# EAGLE schematic half (EAGLE 8.2.2)
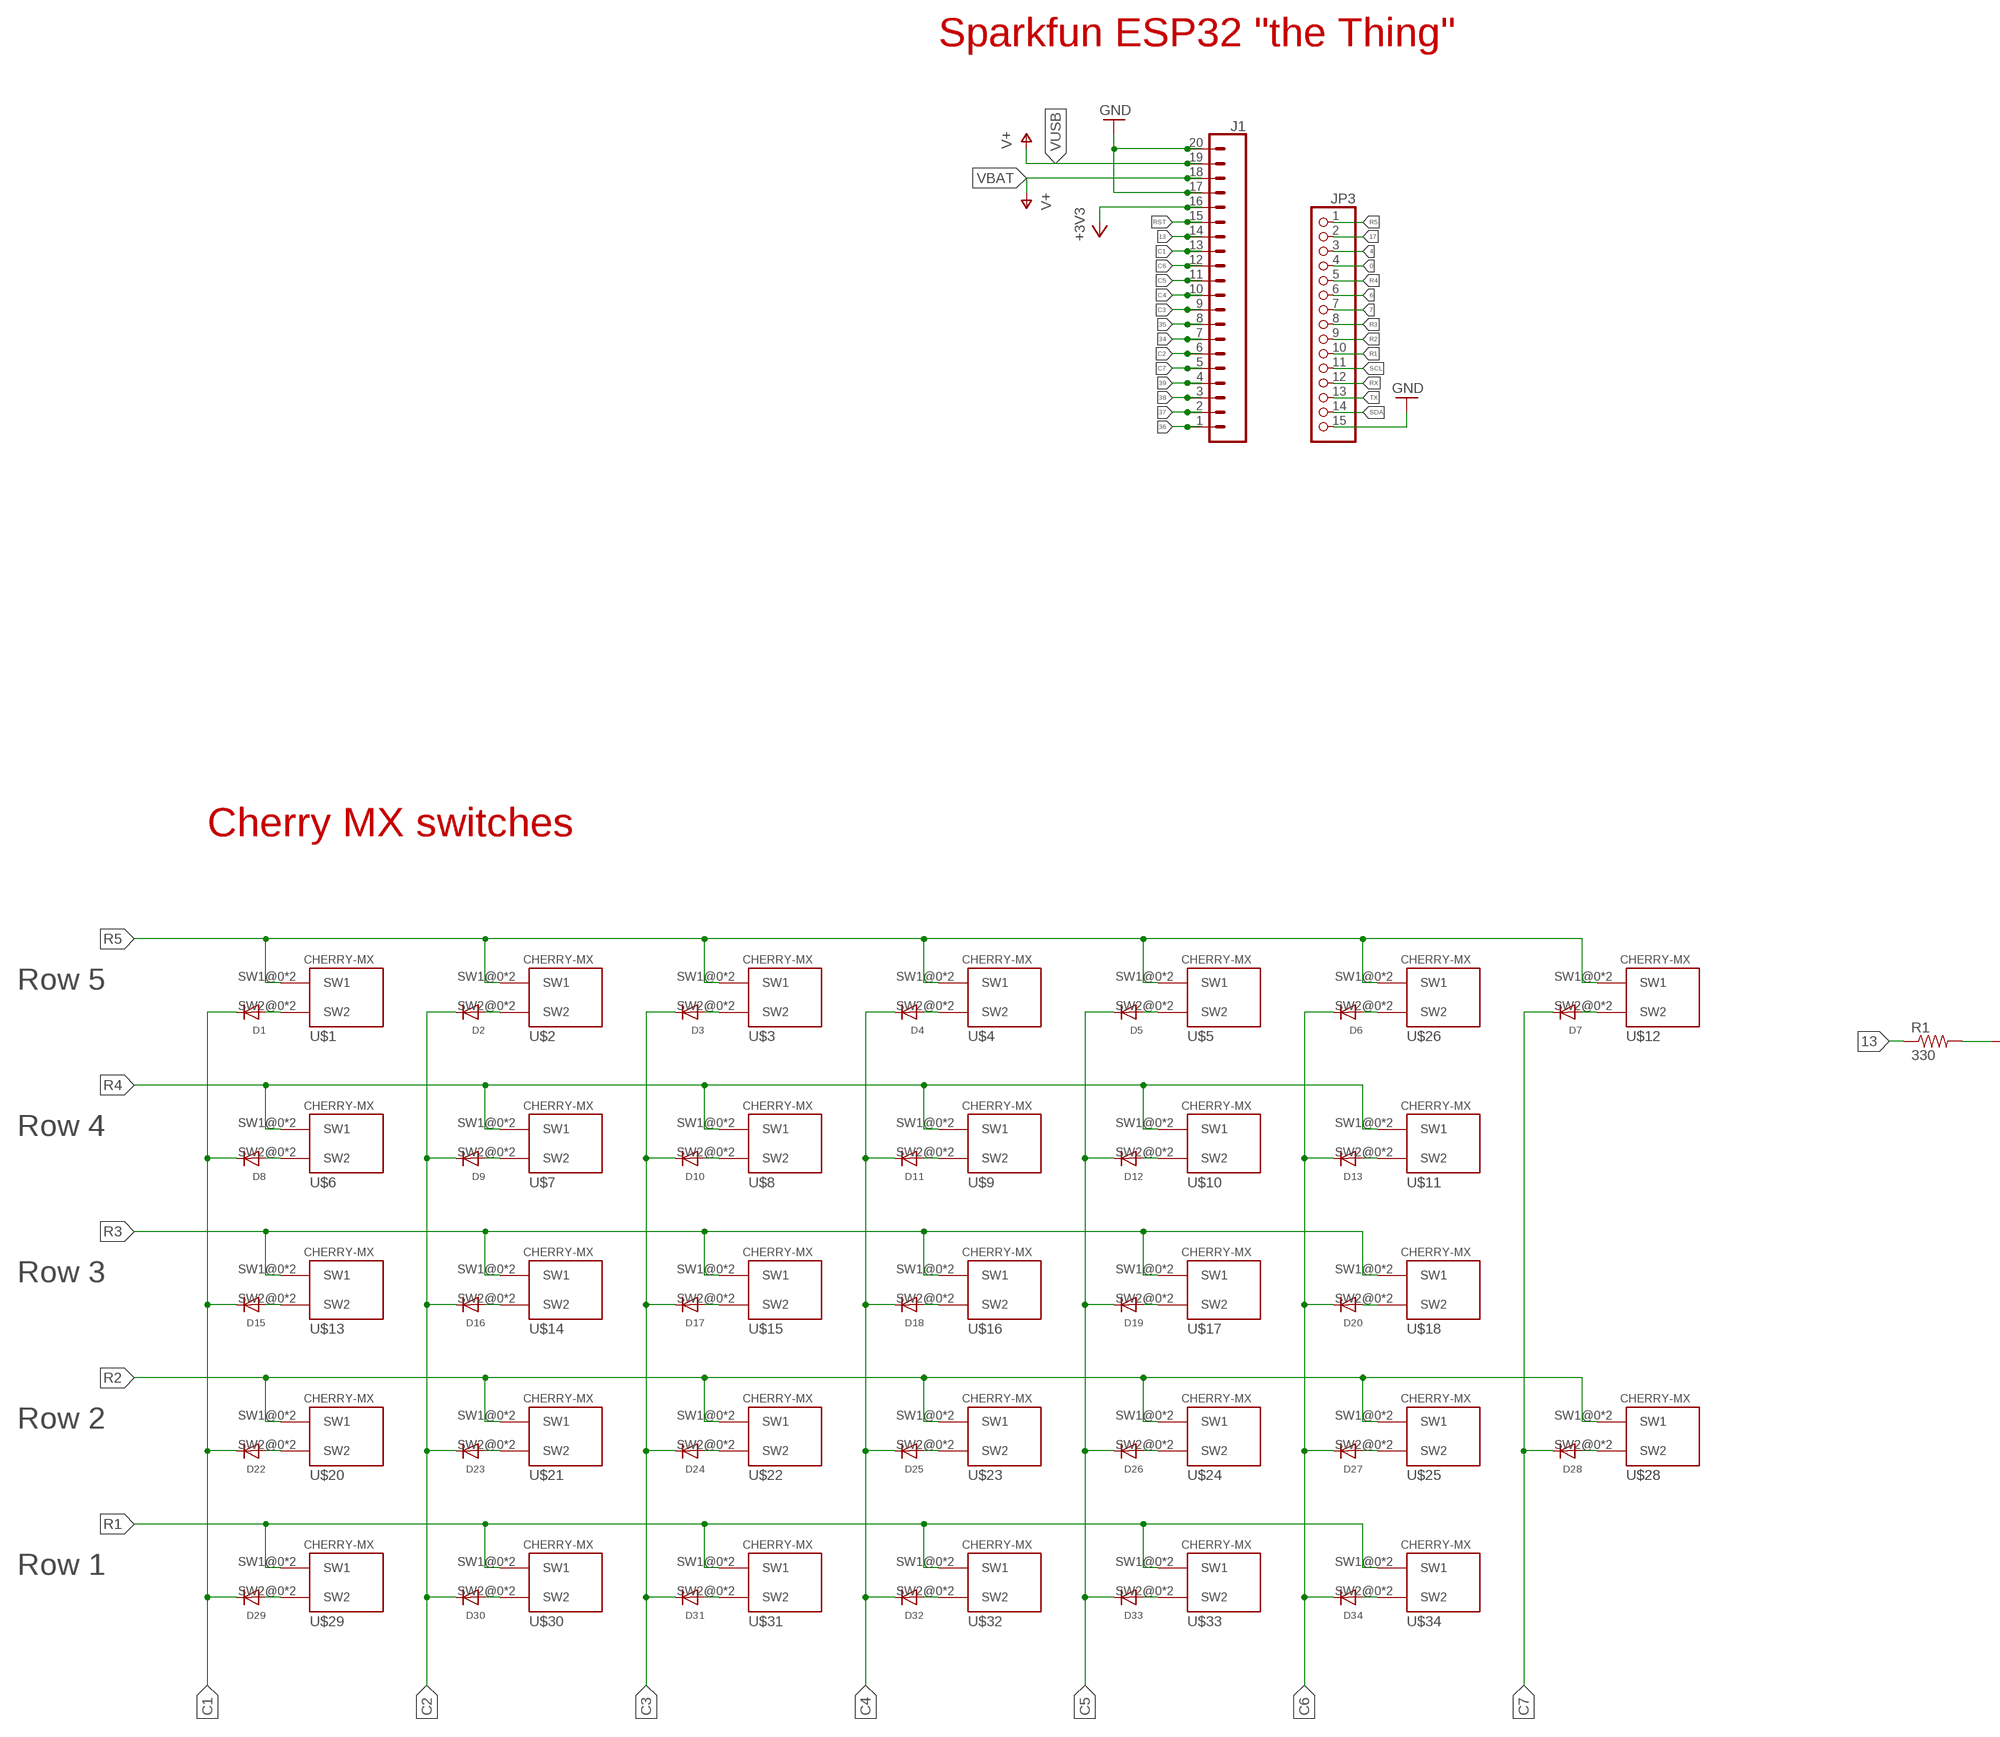
[diagram p0: schematic, sheet 1, part 1 of 3]
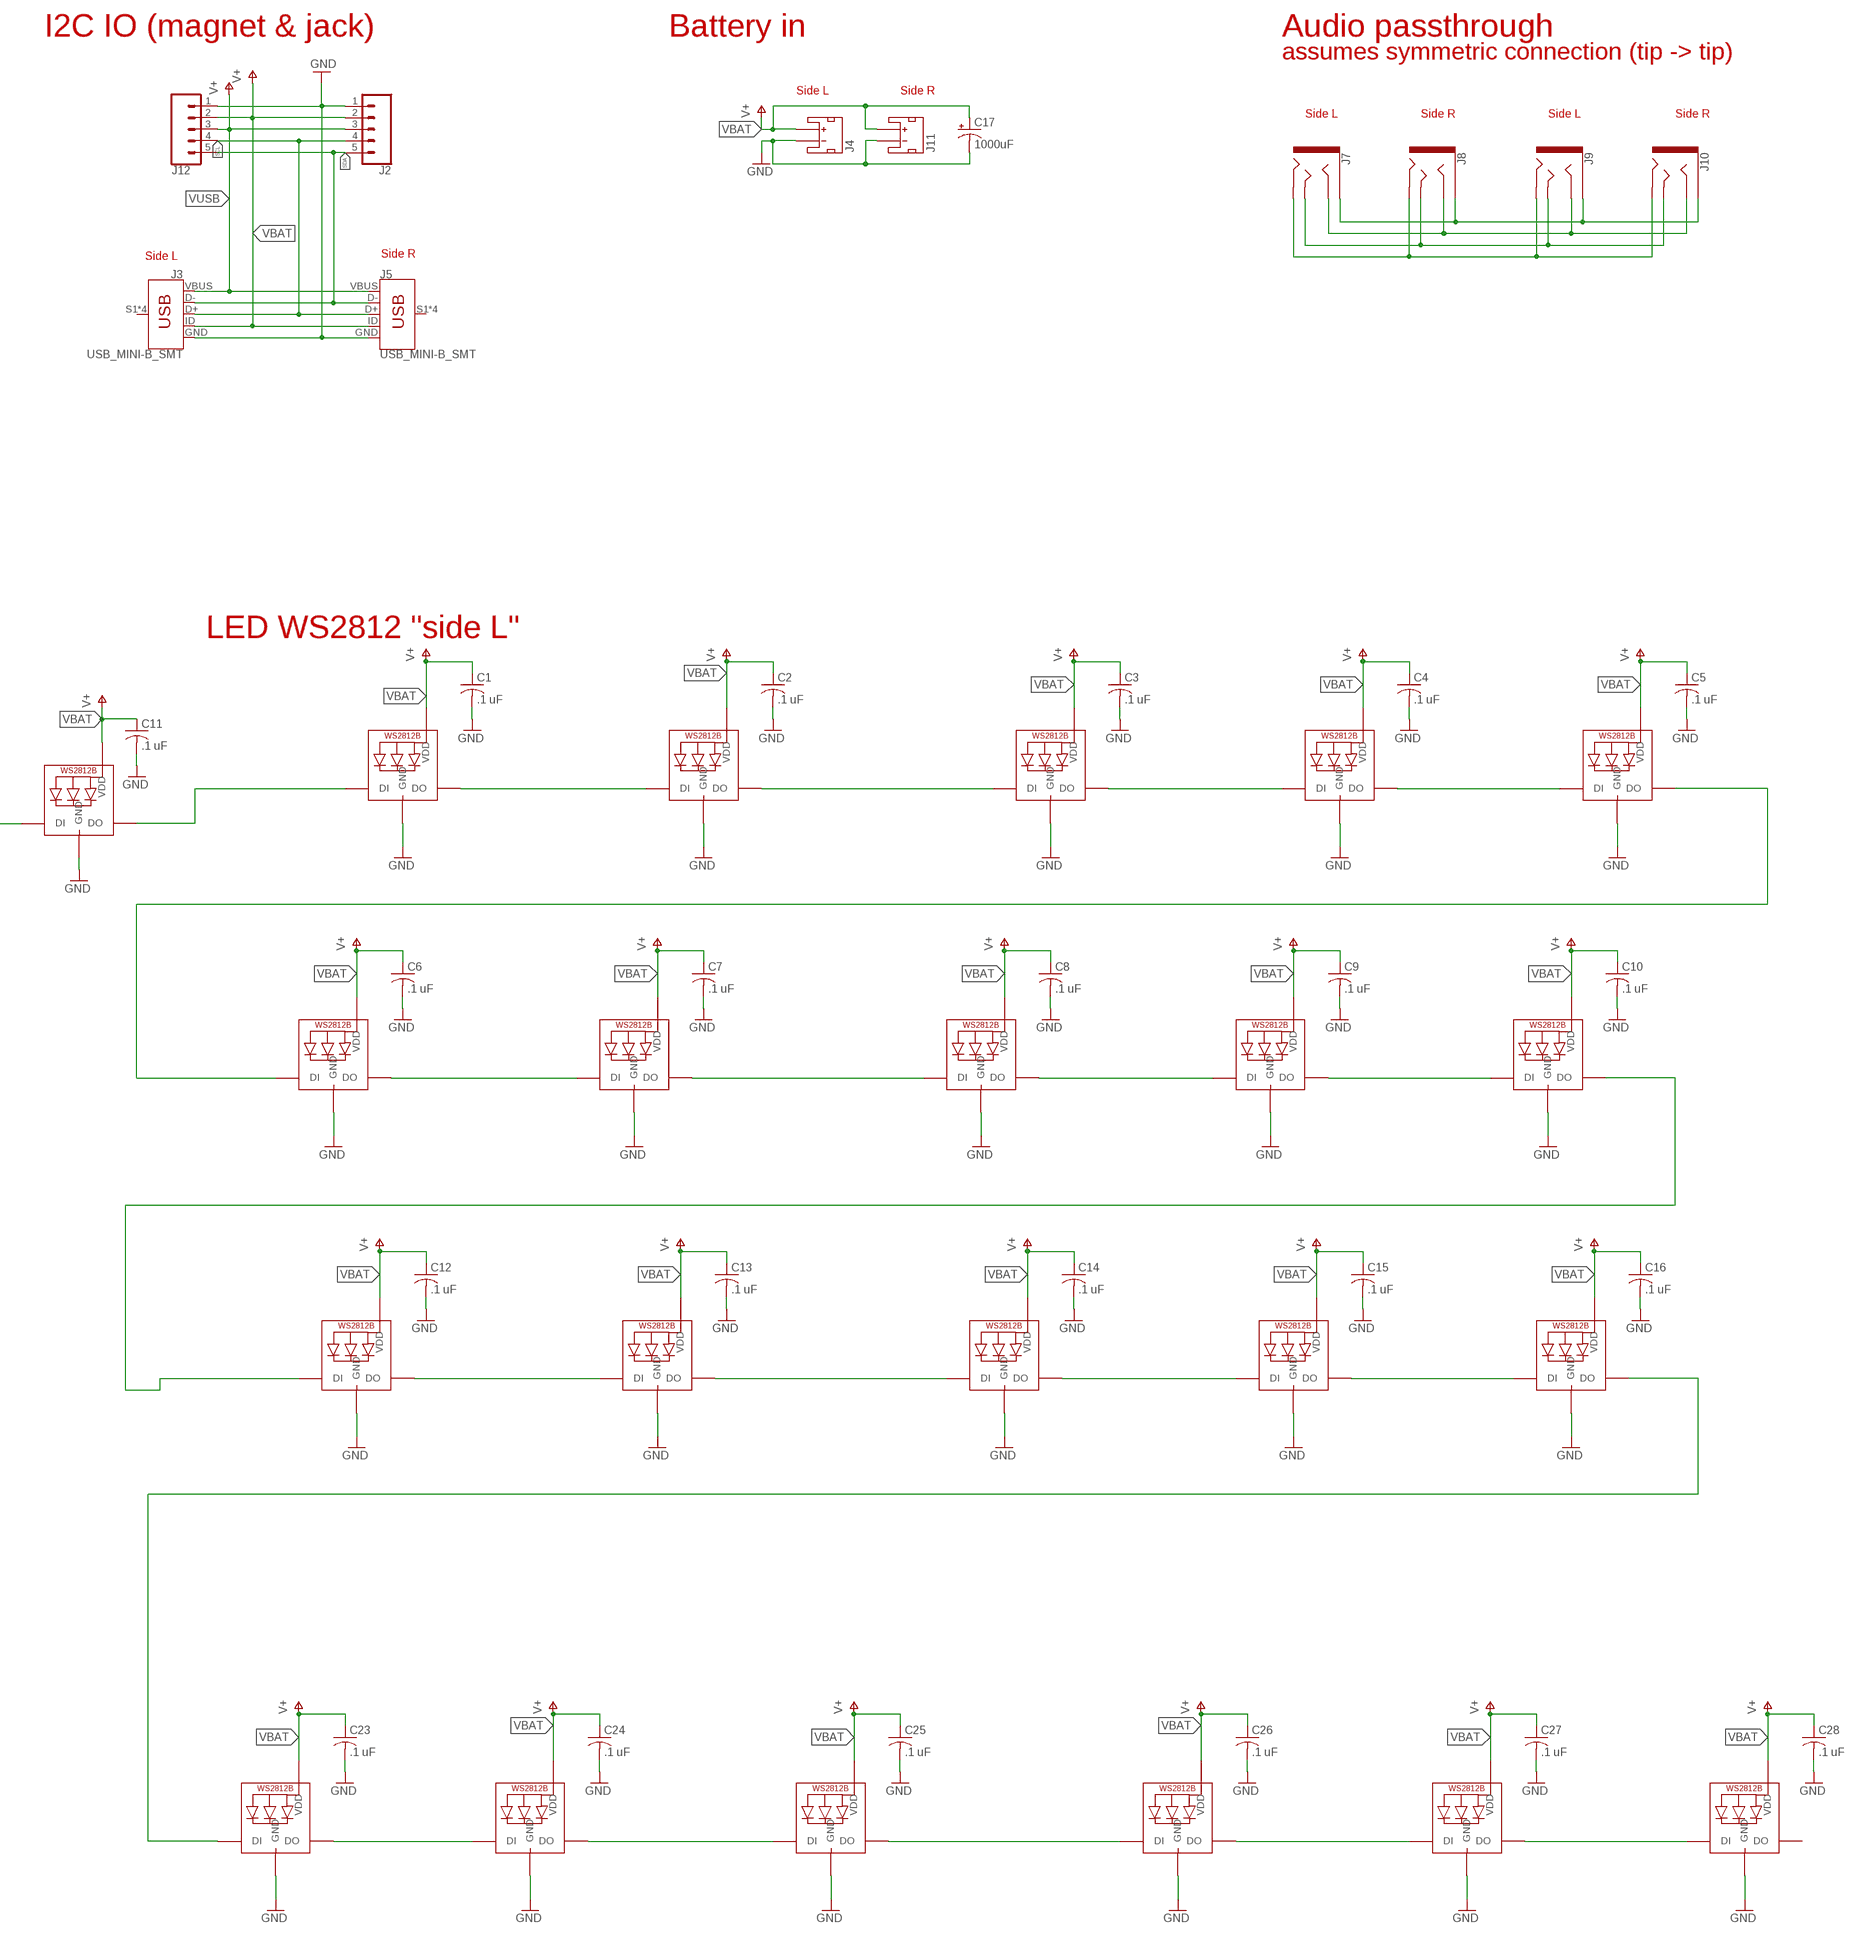
[diagram p1: schematic, sheet 1, part 2 of 3]
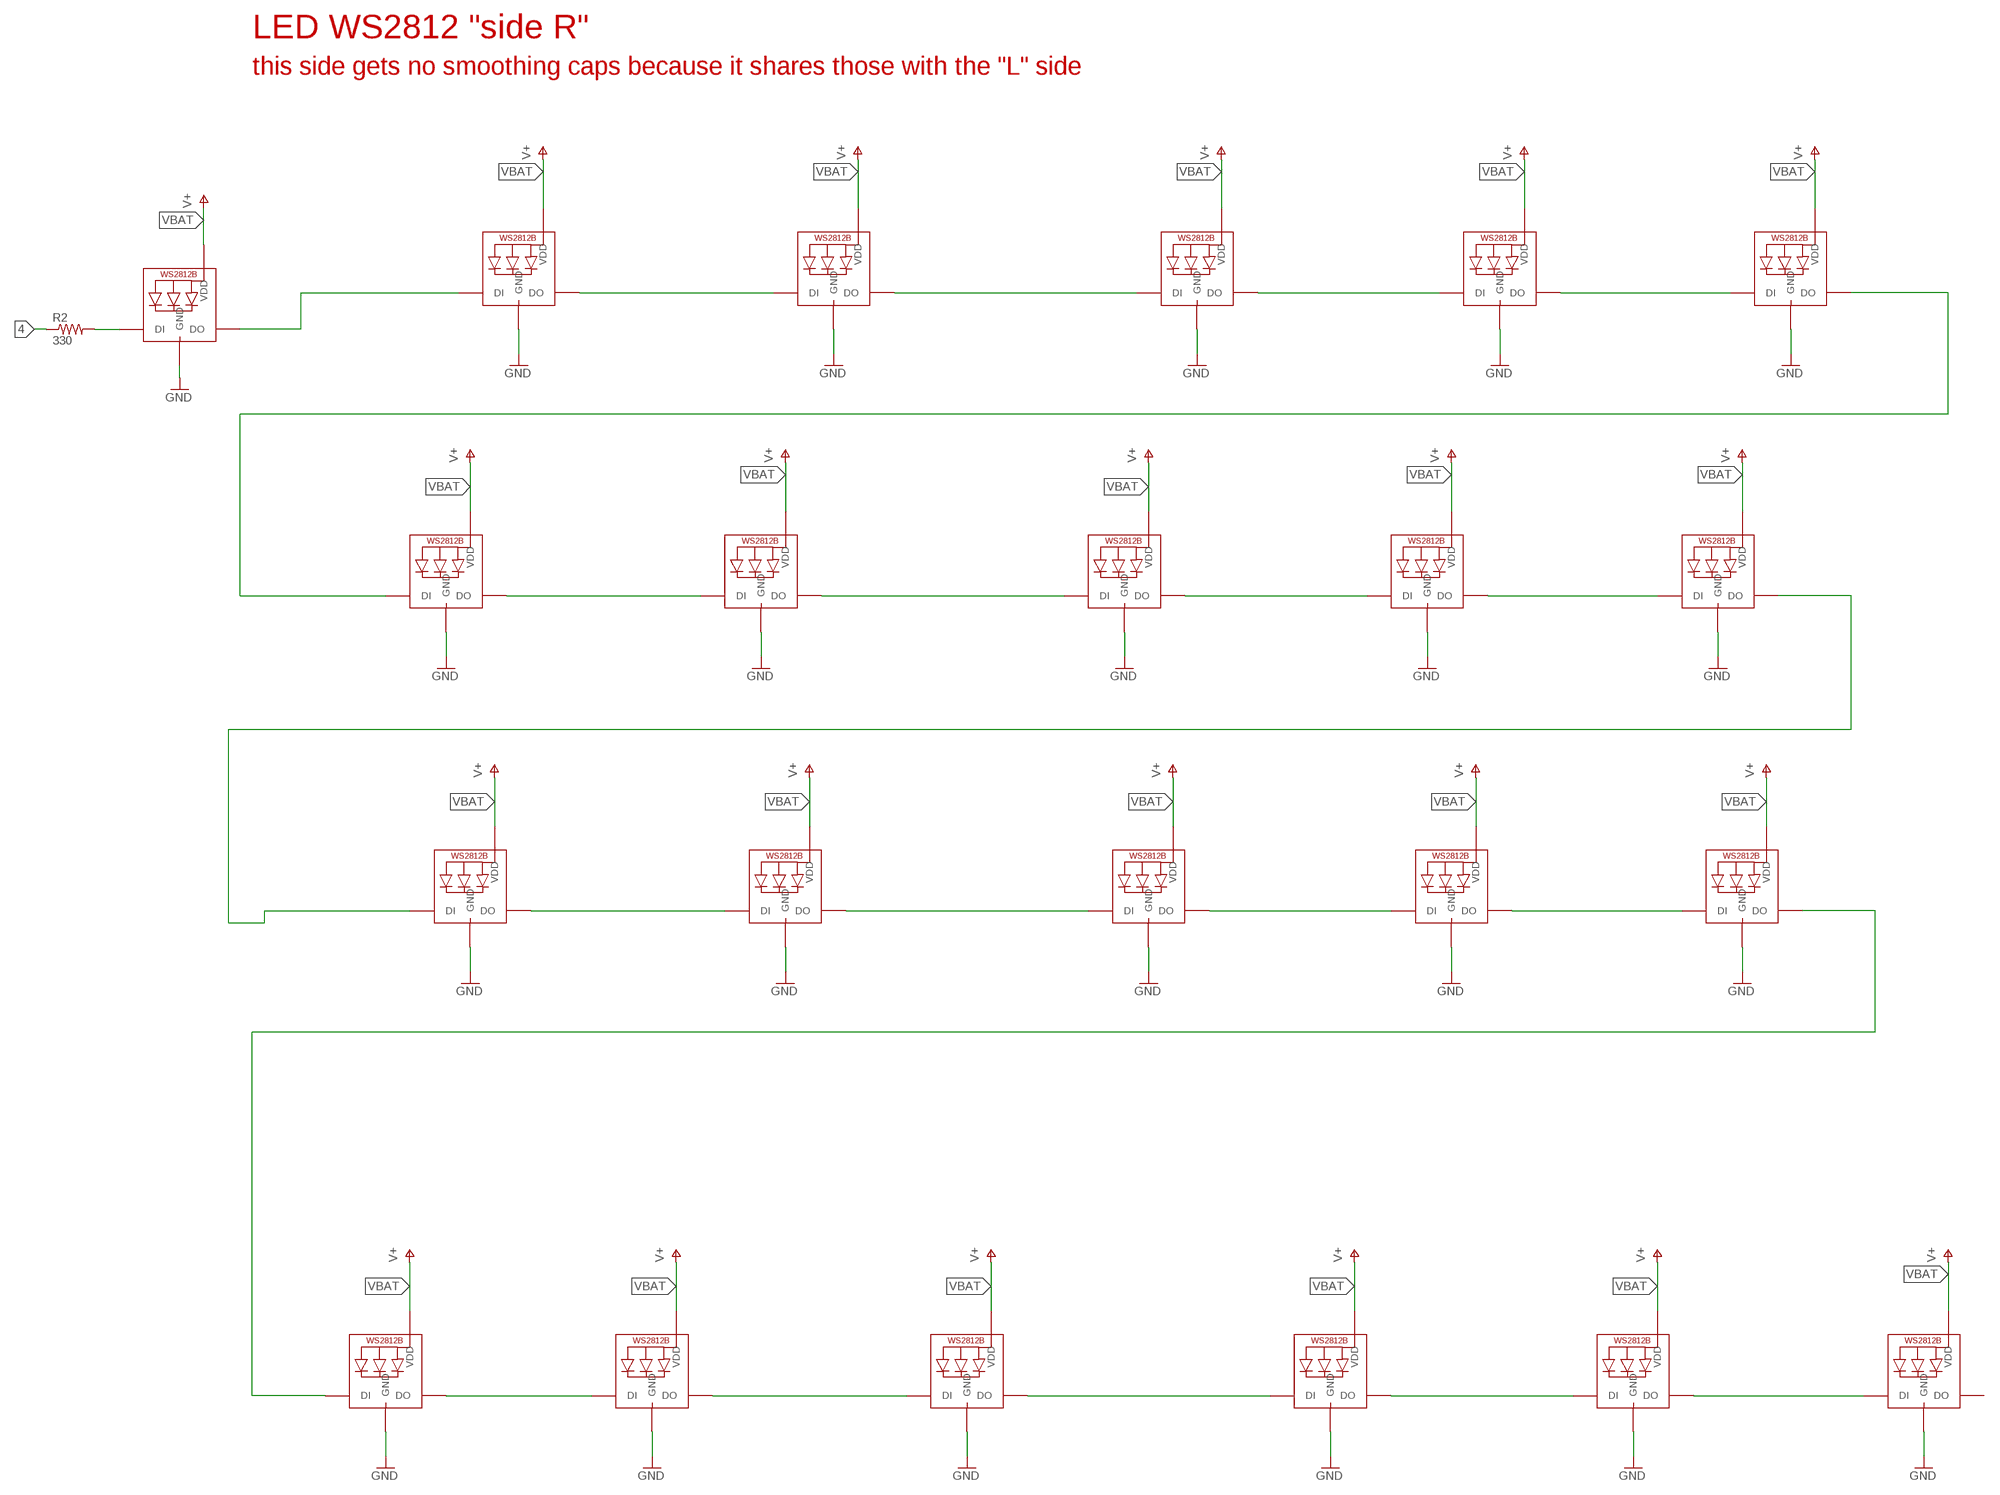
[diagram p2: schematic, sheet 1, part 3 of 3]

## Parts
C1  .1 uF  C-US025-025X050  [C025-025X050]
C2  .1 uF  C-US025-025X050  [C025-025X050]
C3  .1 uF  C-US025-025X050  [C025-025X050]
C4  .1 uF  C-US025-025X050  [C025-025X050]
C5  .1 uF  C-US025-025X050  [C025-025X050]
C6  .1 uF  C-US025-025X050  [C025-025X050]
C7  .1 uF  C-US025-025X050  [C025-025X050]
C8  .1 uF  C-US025-025X050  [C025-025X050]
C9  .1 uF  C-US025-025X050  [C025-025X050]
C10  .1 uF  C-US025-025X050  [C025-025X050]
C11  .1 uF  C-US025-025X050  [C025-025X050]
C12  .1 uF  C-US025-025X050  [C025-025X050]
C13  .1 uF  C-US025-025X050  [C025-025X050]
C14  .1 uF  C-US025-025X050  [C025-025X050]
C15  .1 uF  C-US025-025X050  [C025-025X050]
C16  .1 uF  C-US025-025X050  [C025-025X050]
C17  1000uF  CPOL-USE3.5-8  [E3,5-8]
C23  .1 uF  C-US025-025X050  [C025-025X050]
C24  .1 uF  C-US025-025X050  [C025-025X050]
C25  .1 uF  C-US025-025X050  [C025-025X050]
C26  .1 uF  C-US025-025X050  [C025-025X050]
C27  .1 uF  C-US025-025X050  [C025-025X050]
C28  .1 uF  C-US025-025X050  [C025-025X050]
D1  DIODEDO-1N4148  [DO-1N4148]
D2  DIODEDO-1N4148  [DO-1N4148]
D3  DIODEDO-1N4148  [DO-1N4148]
D4  DIODEDO-1N4148  [DO-1N4148]
D5  DIODEDO-1N4148  [DO-1N4148]
D6  DIODEDO-1N4148  [DO-1N4148]
D7  DIODEDO-1N4148  [DO-1N4148]
D8  DIODEDO-1N4148  [DO-1N4148]
D9  DIODEDO-1N4148  [DO-1N4148]
D10  DIODEDO-1N4148  [DO-1N4148]
D11  DIODEDO-1N4148  [DO-1N4148]
D12  DIODEDO-1N4148  [DO-1N4148]
D13  DIODEDO-1N4148  [DO-1N4148]
D15  DIODEDO-1N4148  [DO-1N4148]
D16  DIODEDO-1N4148  [DO-1N4148]
D17  DIODEDO-1N4148  [DO-1N4148]
D18  DIODEDO-1N4148  [DO-1N4148]
D19  DIODEDO-1N4148  [DO-1N4148]
D20  DIODEDO-1N4148  [DO-1N4148]
D22  DIODEDO-1N4148  [DO-1N4148]
D23  DIODEDO-1N4148  [DO-1N4148]
D24  DIODEDO-1N4148  [DO-1N4148]
D25  DIODEDO-1N4148  [DO-1N4148]
D26  DIODEDO-1N4148  [DO-1N4148]
D27  DIODEDO-1N4148  [DO-1N4148]
D28  DIODEDO-1N4148  [DO-1N4148]
D29  DIODEDO-1N4148  [DO-1N4148]
D30  DIODEDO-1N4148  [DO-1N4148]
D31  DIODEDO-1N4148  [DO-1N4148]
D32  DIODEDO-1N4148  [DO-1N4148]
D33  DIODEDO-1N4148  [DO-1N4148]
D34  DIODEDO-1N4148  [DO-1N4148]
J1  CONN_20NOSILK  [1X20_NOSILK]
J2  CONN_05NO_SILK_SMALL  [1X05_NO_SILK_SMALL]
J3  USB_MINI-B_SMT  [USB-MINIB]
J4  JST_2MM_MALE  [JST-2-SMD]
J5  USB_MINI-B_SMT  [USB-MINIB]
J7  AUDIO_JACK_TRRSSMD_RA  [AUDIO_JACK_3.5MM_TRRS_SMD_RA]
J8  AUDIO_JACK_TRRSSMD_RA  [AUDIO_JACK_3.5MM_TRRS_SMD_RA]
J9  AUDIO_JACK_TRRSSMD_RA  [AUDIO_JACK_3.5MM_TRRS_SMD_RA]
J10  AUDIO_JACK_TRRSSMD_RA  [AUDIO_JACK_3.5MM_TRRS_SMD_RA]
J11  JST_2MM_MALE  [JST-2-SMD]
J12  CONN_05NO_SILK  [1X05_NO_SILK]
JP3  PINHD-1X15-CB  [1X15-CB]
LED1  WS2812BLONGPADS  [WS2812B-NARROW-PADS]
LED2  WS2812BLONGPADS  [WS2812B-NARROW-PADS]
LED3  WS2812BLONGPADS  [WS2812B-NARROW-PADS]
LED4  WS2812BLONGPADS  [WS2812B-NARROW-PADS]
LED5  WS2812BLONGPADS  [WS2812B-NARROW-PADS]
LED6  WS2812BLONGPADS  [WS2812B-NARROW-PADS]
LED7  WS2812BLONGPADS  [WS2812B-NARROW-PADS]
LED8  WS2812BLONGPADS  [WS2812B-NARROW-PADS]
LED9  WS2812BLONGPADS  [WS2812B-NARROW-PADS]
LED10  WS2812BLONGPADS  [WS2812B-NARROW-PADS]
LED11  WS2812BLONGPADS  [WS2812B-NARROW-PADS]
LED12  WS2812BLONGPADS  [WS2812B-NARROW-PADS]
LED13  WS2812BLONGPADS  [WS2812B-NARROW-PADS]
LED14  WS2812BLONGPADS  [WS2812B-NARROW-PADS]
LED15  WS2812BLONGPADS  [WS2812B-NARROW-PADS]
LED16  WS2812BLONGPADS  [WS2812B-NARROW-PADS]
LED17  WS2812BLONGPADS  [WS2812B-NARROW-PADS]
LED18  WS2812BLONGPADS  [WS2812B-NARROW-PADS]
LED19  WS2812BLONGPADS  [WS2812B-NARROW-PADS]
LED20  WS2812BLONGPADS  [WS2812B-NARROW-PADS]
LED21  WS2812BLONGPADS  [WS2812B-NARROW-PADS]
LED22  WS2812BLONGPADS  [WS2812B-NARROW-PADS]
LED23  WS2812BLONGPADS  [WS2812B-NARROW-PADS]
LED24  WS2812BLONGPADS  [WS2812B-NARROW-PADS]
LED25  WS2812BLONGPADS  [WS2812B-NARROW-PADS]
LED26  WS2812BLONGPADS  [WS2812B-NARROW-PADS]
LED27  WS2812BLONGPADS  [WS2812B-NARROW-PADS]
LED28  WS2812BLONGPADS  [WS2812B-NARROW-PADS]
LED29  WS2812BLONGPADS  [WS2812B-NARROW-PADS]
LED30  WS2812BLONGPADS  [WS2812B-NARROW-PADS]
LED31  WS2812BLONGPADS  [WS2812B-NARROW-PADS]
LED32  WS2812BLONGPADS  [WS2812B-NARROW-PADS]
LED33  WS2812BLONGPADS  [WS2812B-NARROW-PADS]
LED34  WS2812BLONGPADS  [WS2812B-NARROW-PADS]
LED35  WS2812BLONGPADS  [WS2812B-NARROW-PADS]
LED36  WS2812BLONGPADS  [WS2812B-NARROW-PADS]
LED37  WS2812BLONGPADS  [WS2812B-NARROW-PADS]
LED38  WS2812BLONGPADS  [WS2812B-NARROW-PADS]
LED39  WS2812BLONGPADS  [WS2812B-NARROW-PADS]
LED40  WS2812BLONGPADS  [WS2812B-NARROW-PADS]
LED41  WS2812BLONGPADS  [WS2812B-NARROW-PADS]
LED42  WS2812BLONGPADS  [WS2812B-NARROW-PADS]
LED43  WS2812BLONGPADS  [WS2812B-NARROW-PADS]
LED44  WS2812BLONGPADS  [WS2812B-NARROW-PADS]
R1  330  R-US_0204/7  [0204/7]
R2  330  R-US_0204/7  [0204/7]
U$1  CHERRY-MXSYMM-NOSILK  [CHERRY-MX-SYMM-NOSILK]
U$2  CHERRY-MXSYMM-NOSILK  [CHERRY-MX-SYMM-NOSILK]
U$3  CHERRY-MXSYMM-NOSILK  [CHERRY-MX-SYMM-NOSILK]
U$4  CHERRY-MXSYMM-NOSILK  [CHERRY-MX-SYMM-NOSILK]
U$5  CHERRY-MXSYMM-NOSILK  [CHERRY-MX-SYMM-NOSILK]
U$6  CHERRY-MXSYMM-NOSILK  [CHERRY-MX-SYMM-NOSILK]
U$7  CHERRY-MXSYMM-NOSILK  [CHERRY-MX-SYMM-NOSILK]
U$8  CHERRY-MXSYMM-NOSILK  [CHERRY-MX-SYMM-NOSILK]
U$9  CHERRY-MXSYMM-NOSILK  [CHERRY-MX-SYMM-NOSILK]
U$10  CHERRY-MXSYMM-NOSILK  [CHERRY-MX-SYMM-NOSILK]
U$11  CHERRY-MXSYMM-NOSILK  [CHERRY-MX-SYMM-NOSILK]
U$12  CHERRY-MXSYMM-NOSILK  [CHERRY-MX-SYMM-NOSILK]
U$13  CHERRY-MXSYMM-NOSILK  [CHERRY-MX-SYMM-NOSILK]
U$14  CHERRY-MXSYMM-NOSILK  [CHERRY-MX-SYMM-NOSILK]
U$15  CHERRY-MXSYMM-NOSILK  [CHERRY-MX-SYMM-NOSILK]
U$16  CHERRY-MXSYMM-NOSILK  [CHERRY-MX-SYMM-NOSILK]
U$17  CHERRY-MXSYMM-NOSILK  [CHERRY-MX-SYMM-NOSILK]
U$18  CHERRY-MXSYMM-NOSILK  [CHERRY-MX-SYMM-NOSILK]
U$20  CHERRY-MXSYMM-NOSILK  [CHERRY-MX-SYMM-NOSILK]
U$21  CHERRY-MXSYMM-NOSILK  [CHERRY-MX-SYMM-NOSILK]
U$22  CHERRY-MXSYMM-NOSILK  [CHERRY-MX-SYMM-NOSILK]
U$23  CHERRY-MXSYMM-NOSILK  [CHERRY-MX-SYMM-NOSILK]
U$24  CHERRY-MXSYMM-NOSILK  [CHERRY-MX-SYMM-NOSILK]
U$25  CHERRY-MXSYMM-NOSILK  [CHERRY-MX-SYMM-NOSILK]
U$26  CHERRY-MXSYMM-NOSILK  [CHERRY-MX-SYMM-NOSILK]
U$28  CHERRY-MXSYMM-NOSILK  [CHERRY-MX-SYMM-NOSILK]
U$29  CHERRY-MXSYMM-NOSILK  [CHERRY-MX-SYMM-NOSILK]
U$30  CHERRY-MXSYMM-NOSILK  [CHERRY-MX-SYMM-NOSILK]
U$31  CHERRY-MXSYMM-NOSILK  [CHERRY-MX-SYMM-NOSILK]
U$32  CHERRY-MXSYMM-NOSILK  [CHERRY-MX-SYMM-NOSILK]
U$33  CHERRY-MXSYMM-NOSILK  [CHERRY-MX-SYMM-NOSILK]
U$34  CHERRY-MXSYMM-NOSILK  [CHERRY-MX-SYMM-NOSILK]

## Nets
0: JP3.4
4: JP3.3 R2.1
6: JP3.6
7: JP3.7
13: J1.14 R1.1
17: JP3.2
34: J1.7
35: J1.8
36: J1.1
37: J1.2
38: J1.3
39: J1.4
+3V3: J1.16
C1: D1.C D8.C D15.C D22.C D29.C J1.13
C2: D2.C D9.C D16.C D23.C D30.C J1.6
C3: D3.C D10.C D17.C D24.C D31.C J1.9
C4: D4.C D11.C D18.C D25.C D32.C J1.10
C5: D5.C D12.C D19.C D26.C D33.C J1.11
C6: D6.C D13.C D20.C D27.C D34.C J1.12
C7: D7.C D28.C J1.5
GND: C1.2 C2.2 C3.2 C4.2 C5.2 C6.2 C7.2 C8.2 C9.2 C10.2 C11.2 C12.2 C13.2 C14.2 C15.2 C16.2 C17.- C23.2 C24.2 C25.2 C26.2 C27.2 C28.2 J1.17 J1.20 J2.1 J3.GND J4.1(-) J5.GND J11.1(-) J12.1 JP3.15 LED1.3-GND(GND) LED2.3-GND(GND) LED3.3-GND(GND) LED4.3-GND(GND) LED5.3-GND(GND) LED6.3-GND(GND) LED7.3-GND(GND) LED8.3-GND(GND) LED9.3-GND(GND) LED10.3-GND(GND) LED11.3-GND(GND) LED12.3-GND(GND) LED13.3-GND(GND) LED14.3-GND(GND) LED15.3-GND(GND) LED16.3-GND(GND) LED17.3-GND(GND) LED18.3-GND(GND) LED19.3-GND(GND) LED20.3-GND(GND) LED21.3-GND(GND) LED22.3-GND(GND) LED23.3-GND(GND) LED24.3-GND(GND) LED25.3-GND(GND) LED26.3-GND(GND) LED27.3-GND(GND) LED28.3-GND(GND) LED29.3-GND(GND) LED30.3-GND(GND) LED31.3-GND(GND) LED32.3-GND(GND) LED33.3-GND(GND) LED34.3-GND(GND) LED35.3-GND(GND) LED36.3-GND(GND) LED37.3-GND(GND) LED38.3-GND(GND) LED39.3-GND(GND) LED40.3-GND(GND) LED41.3-GND(GND) LED42.3-GND(GND) LED43.3-GND(GND) LED44.3-GND(GND)
N$1: D1.A U$1.SW2@0(SW2) U$1.SW2@1(SW2)
N$2: D28.A U$28.SW2@0(SW2) U$28.SW2@1(SW2)
N$3: D8.A U$6.SW2@0(SW2) U$6.SW2@1(SW2)
N$4: D15.A U$13.SW2@0(SW2) U$13.SW2@1(SW2)
N$5: D22.A U$20.SW2@0(SW2) U$20.SW2@1(SW2)
N$6: D29.A U$29.SW2@0(SW2) U$29.SW2@1(SW2)
N$7: D7.A U$12.SW2@0(SW2) U$12.SW2@1(SW2)
N$8: D2.A U$2.SW2@0(SW2) U$2.SW2@1(SW2)
N$9: D9.A U$7.SW2@0(SW2) U$7.SW2@1(SW2)
N$10: D16.A U$14.SW2@0(SW2) U$14.SW2@1(SW2)
N$11: D30.A U$30.SW2@0(SW2) U$30.SW2@1(SW2)
N$12: D31.A U$31.SW2@0(SW2) U$31.SW2@1(SW2)
N$13: D24.A U$22.SW2@0(SW2) U$22.SW2@1(SW2)
N$14: D17.A U$15.SW2@0(SW2) U$15.SW2@1(SW2)
N$15: D10.A U$8.SW2@0(SW2) U$8.SW2@1(SW2)
N$16: D3.A U$3.SW2@0(SW2) U$3.SW2@1(SW2)
N$17: D4.A U$4.SW2@0(SW2) U$4.SW2@1(SW2)
N$18: D11.A U$9.SW2@0(SW2) U$9.SW2@1(SW2)
N$19: D18.A U$16.SW2@0(SW2) U$16.SW2@1(SW2)
N$20: D25.A U$23.SW2@0(SW2) U$23.SW2@1(SW2)
N$21: D32.A U$32.SW2@0(SW2) U$32.SW2@1(SW2)
N$22: D33.A U$33.SW2@0(SW2) U$33.SW2@1(SW2)
N$23: D26.A U$24.SW2@0(SW2) U$24.SW2@1(SW2)
N$24: D19.A U$17.SW2@0(SW2) U$17.SW2@1(SW2)
N$25: D12.A U$10.SW2@0(SW2) U$10.SW2@1(SW2)
N$26: D5.A U$5.SW2@0(SW2) U$5.SW2@1(SW2)
N$27: D6.A U$26.SW2@0(SW2) U$26.SW2@1(SW2)
N$28: D13.A U$11.SW2@0(SW2) U$11.SW2@1(SW2)
N$29: D20.A U$18.SW2@0(SW2) U$18.SW2@1(SW2)
N$30: D27.A U$25.SW2@0(SW2) U$25.SW2@1(SW2)
N$31: D34.A U$34.SW2@0(SW2) U$34.SW2@1(SW2)
N$33: LED1.2-DOUT(DO) LED18.4-DIN(DI)
N$34: LED18.2-DOUT(DO) LED19.4-DIN(DI)
N$35: LED19.2-DOUT(DO) LED20.4-DIN(DI)
N$36: J7.RING1 J8.RING1 J9.RING1 J10.RING1
N$37: LED13.4-DIN(DI) LED22.2-DOUT(DO)
N$38: D23.A U$21.SW2@0(SW2) U$21.SW2@1(SW2)
N$39: LED20.2-DOUT(DO) LED21.4-DIN(DI)
N$40: LED13.2-DOUT(DO) LED14.4-DIN(DI)
N$41: LED14.2-DOUT(DO) LED15.4-DIN(DI)
N$42: LED21.2-DOUT(DO) LED22.4-DIN(DI)
N$43: J7.TIP J8.TIP J9.TIP J10.TIP
N$44: J7.RING2 J8.RING2 J9.RING2 J10.RING2
N$45: J7.EARTH J8.EARTH J9.EARTH J10.EARTH
N$46: LED30.4-DIN(DI) LED39.2-DOUT(DO)
N$47: LED24.4-DIN(DI) LED34.2-DOUT(DO)
N$48: LED1.4-DIN(DI) R1.2
N$49: LED15.2-DOUT(DO) LED16.4-DIN(DI)
N$50: LED8.2-DOUT(DO) LED9.4-DIN(DI)
N$51: LED9.2-DOUT(DO) LED10.4-DIN(DI)
N$52: LED10.2-DOUT(DO) LED11.4-DIN(DI)
N$53: LED2.2-DOUT(DO) LED3.4-DIN(DI)
N$54: LED8.4-DIN(DI) LED17.2-DOUT(DO)
N$55: LED3.2-DOUT(DO) LED4.4-DIN(DI)
N$56: LED4.2-DOUT(DO) LED5.4-DIN(DI)
N$57: LED5.2-DOUT(DO) LED6.4-DIN(DI)
N$58: LED2.4-DIN(DI) LED12.2-DOUT(DO)
N$59: LED6.2-DOUT(DO) LED7.4-DIN(DI)
N$60: LED11.2-DOUT(DO) LED12.4-DIN(DI)
N$61: LED16.2-DOUT(DO) LED17.4-DIN(DI)
N$62: LED23.4-DIN(DI) R2.2
N$63: LED24.2-DOUT(DO) LED25.4-DIN(DI)
N$64: LED25.2-DOUT(DO) LED26.4-DIN(DI)
N$65: LED26.2-DOUT(DO) LED27.4-DIN(DI)
N$66: LED27.2-DOUT(DO) LED28.4-DIN(DI)
N$67: LED28.2-DOUT(DO) LED29.4-DIN(DI)
N$68: LED30.2-DOUT(DO) LED31.4-DIN(DI)
N$69: LED31.2-DOUT(DO) LED32.4-DIN(DI)
N$70: LED32.2-DOUT(DO) LED33.4-DIN(DI)
N$71: LED33.2-DOUT(DO) LED34.4-DIN(DI)
N$72: LED35.4-DIN(DI) LED44.2-DOUT(DO)
N$73: LED35.2-DOUT(DO) LED36.4-DIN(DI)
N$74: LED36.2-DOUT(DO) LED37.4-DIN(DI)
N$75: LED37.2-DOUT(DO) LED38.4-DIN(DI)
N$76: LED38.2-DOUT(DO) LED39.4-DIN(DI)
N$77: LED23.2-DOUT(DO) LED40.4-DIN(DI)
N$78: LED40.2-DOUT(DO) LED41.4-DIN(DI)
N$79: LED41.2-DOUT(DO) LED42.4-DIN(DI)
N$80: LED42.2-DOUT(DO) LED43.4-DIN(DI)
N$81: LED43.2-DOUT(DO) LED44.4-DIN(DI)
R1: JP3.10 U$29.SW1@0(SW1) U$29.SW1@1(SW1) U$30.SW1@0(SW1) U$30.SW1@1(SW1) U$31.SW1@0(SW1) U$31.SW1@1(SW1) U$32.SW1@0(SW1) U$32.SW1@1(SW1) U$33.SW1@0(SW1) U$33.SW1@1(SW1) U$34.SW1@0(SW1) U$34.SW1@1(SW1)
R2: JP3.9 U$20.SW1@0(SW1) U$20.SW1@1(SW1) U$21.SW1@0(SW1) U$21.SW1@1(SW1) U$22.SW1@0(SW1) U$22.SW1@1(SW1) U$23.SW1@0(SW1) U$23.SW1@1(SW1) U$24.SW1@0(SW1) U$24.SW1@1(SW1) U$25.SW1@0(SW1) U$25.SW1@1(SW1) U$28.SW1@0(SW1) U$28.SW1@1(SW1)
R3: JP3.8 U$13.SW1@0(SW1) U$13.SW1@1(SW1) U$14.SW1@0(SW1) U$14.SW1@1(SW1) U$15.SW1@0(SW1) U$15.SW1@1(SW1) U$16.SW1@0(SW1) U$16.SW1@1(SW1) U$17.SW1@0(SW1) U$17.SW1@1(SW1) U$18.SW1@0(SW1) U$18.SW1@1(SW1)
R4: JP3.5 U$6.SW1@0(SW1) U$6.SW1@1(SW1) U$7.SW1@0(SW1) U$7.SW1@1(SW1) U$8.SW1@0(SW1) U$8.SW1@1(SW1) U$9.SW1@0(SW1) U$9.SW1@1(SW1) U$10.SW1@0(SW1) U$10.SW1@1(SW1) U$11.SW1@0(SW1) U$11.SW1@1(SW1)
R5: JP3.1 U$1.SW1@0(SW1) U$1.SW1@1(SW1) U$2.SW1@0(SW1) U$2.SW1@1(SW1) U$3.SW1@0(SW1) U$3.SW1@1(SW1) U$4.SW1@0(SW1) U$4.SW1@1(SW1) U$5.SW1@0(SW1) U$5.SW1@1(SW1) U$12.SW1@0(SW1) U$12.SW1@1(SW1) U$26.SW1@0(SW1) U$26.SW1@1(SW1)
RST: J1.15
RX: JP3.12
SCL: J2.4 J3.D+ J5.D+ J12.4 JP3.11
SDA: J2.5 J3.D- J5.D- J12.5 JP3.14
TX: JP3.13
VBAT: C1.1 C2.1 C3.1 C4.1 C5.1 C6.1 C7.1 C8.1 C9.1 C10.1 C11.1 C12.1 C13.1 C14.1 C15.1 C16.1 C17.+ C23.1 C24.1 C25.1 C26.1 C27.1 C28.1 J1.18 J2.2 J3.ID J4.2(+) J5.ID J11.2(+) J12.2 LED1.1-VDD(VDD) LED2.1-VDD(VDD) LED3.1-VDD(VDD) LED4.1-VDD(VDD) LED5.1-VDD(VDD) LED6.1-VDD(VDD) LED7.1-VDD(VDD) LED8.1-VDD(VDD) LED9.1-VDD(VDD) LED10.1-VDD(VDD) LED11.1-VDD(VDD) LED12.1-VDD(VDD) LED13.1-VDD(VDD) LED14.1-VDD(VDD) LED15.1-VDD(VDD) LED16.1-VDD(VDD) LED17.1-VDD(VDD) LED18.1-VDD(VDD) LED19.1-VDD(VDD) LED20.1-VDD(VDD) LED21.1-VDD(VDD) LED22.1-VDD(VDD) LED23.1-VDD(VDD) LED24.1-VDD(VDD) LED25.1-VDD(VDD) LED26.1-VDD(VDD) LED27.1-VDD(VDD) LED28.1-VDD(VDD) LED29.1-VDD(VDD) LED30.1-VDD(VDD) LED31.1-VDD(VDD) LED32.1-VDD(VDD) LED33.1-VDD(VDD) LED34.1-VDD(VDD) LED35.1-VDD(VDD) LED36.1-VDD(VDD) LED37.1-VDD(VDD) LED38.1-VDD(VDD) LED39.1-VDD(VDD) LED40.1-VDD(VDD) LED41.1-VDD(VDD) LED42.1-VDD(VDD) LED43.1-VDD(VDD) LED44.1-VDD(VDD) ; supply symbol labelled V+
VUSB: J1.19 J2.3 J3.VBUS J5.VBUS J12.3 ; supply symbol labelled V+
Unconnected: J3.S1(SHIELD) J3.S2(SHIELD) J3.S3(SHIELD) J3.S4(SHIELD) J4.NC1(PAD1) J4.NC2(PAD2) J5.S1(SHIELD) J5.S2(SHIELD) J5.S3(SHIELD) J5.S4(SHIELD) J11.NC1(PAD1) J11.NC2(PAD2) LED7.2-DOUT(DO) LED29.2-DOUT(DO)

## Notes on the sheet
- Sparkfun ESP32 "the Thing" | I2C IO (magnet & jack) | Battery in | Audio passthrough
- assumes symmetric connection (tip -> tip)
- Side L | Side R
- Side L | Side R | Side L | Side R
- Side L | Side R
- LED WS2812 "side L"
- Cherry MX switches
- LED WS2812 "side R"
- Row 5
- this side gets no smoothing caps because it shares those with the "L" side
- Row 4
- Row 3
- Row 2
- Row 1

## Library data of the parts
C1-C16 C23-C28 = adafruit:C-US: CAPACITOR, American symbol
C17 = adafruit:CPOL-US: POLARIZED CAPACITOR, American symbol
D1-D13 D15-D20 D22-D34 = adafruit:DIODE: Diode SMADIODE - SMA Surface Mount Package 20V 1A Schottky Diode Digikey: 641-1014-6-ND DO-1N4148 - Through Hole Small Current Diode SOD-123 20V 1 A (.5mV Vf) Schottky Diode - Digikey: MBRX120TPMSCT-ND SOD-323 10V 570mA (.38mV Vf, 3ns) Schottky Diode - Digikey: ZLLS410CT-ND SOD-523 30V 30mA Schottky Diode (RB751S-40TE61) - Digikey: RB751S-40TE61CT-ND SOT23-R/W - SOT23 Package (R = Solder Paste/Reflow Ovens, W = Hand-Soldering) BAT54Film 40V 300mA - Digikey: 497-7162-1-ND
J1 = SparkFun-Connectors:CONN_20: Multi connection point. Often used as Generic Header-pin footprint for 0.1 inch spaced/style header connections On any of the 0.1 inch spaced packages, you can populate with these: Break Away Headers - Straight <https://www.sparkfun.com/products/116> (PRT-00116) Break Away Male Headers - Right Angle <https://www.sparkfun.com/products/553> (PRT-00553) Female Headers <https://www.sparkfun.com/products/115> (PRT-00115) Break Away Headers - Machine Pin <https://www.sparkfun.com/products/117> (PRT-00117) Break Away Female Headers - Swiss Machine Pin <https://www.sparkfun.com/products/743> (PRT-00743) For SCREWTERMINALS and SPRING TERMINALS visit here: Screw Terimnals on SparkFun.com <https://www.sparkfun.com/search/results?term=Screw+Terminals> (5mm/3.5mm/2.54mm spacing) This device is also useful as a general connection point to wire up your design to another part of your project. Our various solder wires solder well into these plated through hole pads. Hook-Up Wire - Assortment (Stranded, 22 AWG) <https://www.sparkfun.com/products/11375> (PRT-11375) Hook-Up Wire - Assortment (Solid Core, 22 AWG) <https://www.sparkfun.com/products/11367> (PRT-11367) View the entire wire category on our website here <https://www.sparkfun.com/categories/141> Special notes: Molex polarized connector foot print use with SKU : PRT-08231 with associated crimp pins and housings. 1MM SMD Version SKU: PRT-10208 NOTES ON THE VARIANTS LOCK and LOCK_LONGPADS... This footprint was designed to help hold the alignment of a through-hole component (i.e. 6-pin header) while soldering it into place. You may notice that each hole has been shifted either up or down by 0.005 of an inch from it's more standard position (which is a perfectly straight line). This slight alteration caused the pins (the squares in the middle) to touch the edges of the holes. Because they are alternating, it causes a "brace" to hold the component in place. 0.005 has proven to be the perfect amount of "off-center" position when using our standard breakaway headers. Although looks a little odd when you look at the bare footprint, once you have a header in there, the alteration is very hard to notice. Also,if you push a header all the way into place, it is covered up entirely on the bottom side. Note about LOCK SPECIAL package: This is just like the LOCK variant in that the holes are staggared by 5 mil, but except for the last two holes. They are not altered from the "standard" footprint layout. This is used for a special purpose on the layout of our Graphic LCD Backpack. Make sure you want to use this device before selecting it for you project!
J2 J12 = SparkFun-Connectors:CONN_05: Multi connection point. Often used as Generic Header-pin footprint for 0.1 inch spaced/style header connections On any of the 0.1 inch spaced packages, you can populate with these: Break Away Headers - Straight <https://www.sparkfun.com/products/116> (PRT-00116) Break Away Male Headers - Right Angle <https://www.sparkfun.com/products/553> (PRT-00553) Female Headers <https://www.sparkfun.com/products/115> (PRT-00115) Break Away Headers - Machine Pin <https://www.sparkfun.com/products/117> (PRT-00117) Break Away Female Headers - Swiss Machine Pin <https://www.sparkfun.com/products/743> (PRT-00743) For SCREWTERMINALS and SPRING TERMINALS visit here: Screw Terimnals on SparkFun.com <https://www.sparkfun.com/search/results?term=Screw+Terminals> (5mm/3.5mm/2.54mm spacing) This device is also useful as a general connection point to wire up your design to another part of your project. Our various solder wires solder well into these plated through hole pads. Hook-Up Wire - Assortment (Stranded, 22 AWG) <https://www.sparkfun.com/products/11375> (PRT-11375) Hook-Up Wire - Assortment (Solid Core, 22 AWG) <https://www.sparkfun.com/products/11367> (PRT-11367) View the entire wire category on our website here <https://www.sparkfun.com/categories/141> Special notes: Molex polarized connector foot print use with SKU : PRT-08231 with associated crimp pins and housings. 1MM SMD Version SKU: PRT-10208
J3 J5 = SparkFun-Connectors:USB_MINI-B: USB type Mini-B Connector Breaks out 5th pin, and includes shield pins if needed. SparkFun Products: SparkFun FTDI Basic Breakout <https://www.sparkfun.com/products/9716> SparkFun XBee Explorer USB <https://www.sparkfun.com/products/11812> SparkFun Redboard <https://www.sparkfun.com/products/12757>; PROD_ID: CONN-08193; SF_ID: PRT-00587
J4 J11 = SparkFun-Connectors:JST_2MM_MALE: JST 2MM MALE RA CONNECTOR Two pin, compact surface mount connector. Commonly used as a battery input connection point. We really like the solid locking feeling and high current rating on these small connectors. We use these all the time as battery connectors. Mates to single-cell LiPo batteries. Here is the connector we sell at SparkFun: JST Right Angle Connector - White <https://www.sparkfun.com/products/8612> (PRT-08612) Datasheet <http://www.sparkfun.com/datasheets/Prototyping/Connectors/JST-Horizontal.pdf> It was used on these SparkFun products: SparkFun MOSFET Power Controller <https://www.sparkfun.com/products/11214> (PRT-11214) SparkFun Battery Babysitter - LiPo Battery Manager <https://www.sparkfun.com/products/13777> (PRT-13777) And many, many others that required a lipo battery connection.; PROD_ID: CONN-11443; SF_ID: PRT-08612
J7-J10 = SparkFun-Connectors:AUDIO_JACK_TRRS: Audio Jack - 3.5mm TRRS (SMD) This is a 3.5mm TRRS SMD audio jack. TRRS connectors are the audio-style connectors that you see on some phones, MP3 players and development boards. TRRS stands for “tip, ring, ring, sleeve,” which reflects that this has three conductors and a ground. SparkFun Products: Audio Jack <https://www.sparkfun.com/products/12639> mbed Starter Kit <https://www.sparkfun.com/products/12968> SparkFun TRRS 3.5mm Jack Breakout <https://www.sparkfun.com/products/11570>; PROD_ID: CONN-10676; SF_ID: PRT-12639
JP3 = adafruit:PINHD-1X15: PIN HEADER
LED1-LED44 = adafruit:WS2812B
R1 R2 = adafruit:R-US_: RESISTOR, American symbol
U$1-U$18 U$20-U$26 U$28-U$34 = cherrymx:CHERRY-MX: Cherry MX series keyswitch